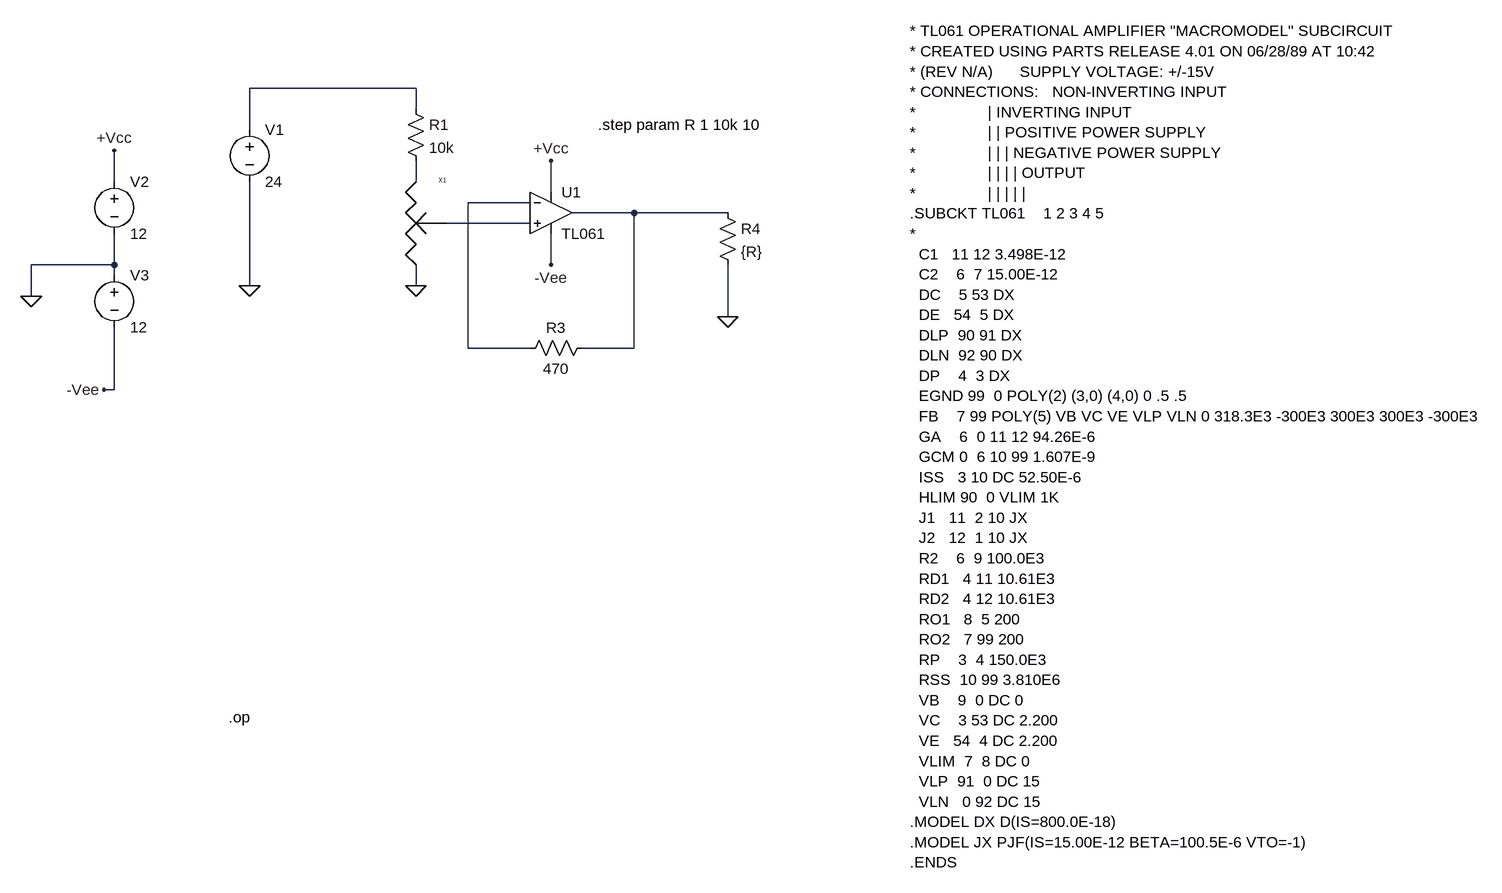
[diagram p0: schematic uklad.asc]
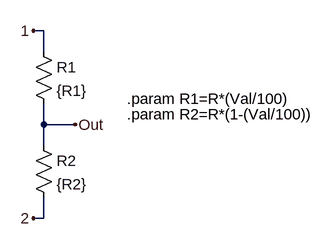
[diagram p1: sub-circuit potentiometer.asc]
uklad.asc, the LTspice schematic file:
Version 4
SHEET 1 3900 1348
WIRE -16 272 -272 272
WIRE -16 304 -16 272
WIRE -272 336 -272 272
WIRE -480 416 -480 368
WIRE -16 416 -16 384
WIRE 192 432 192 384
WIRE 160 448 64 448
WIRE 320 464 224 464
WIRE 464 464 320 464
WIRE 160 480 32 480
WIRE -480 544 -480 496
WIRE -480 544 -608 544
WIRE 192 544 192 496
WIRE -480 560 -480 544
WIRE -272 576 -272 416
WIRE -16 576 -16 544
WIRE -608 592 -608 544
WIRE 464 624 464 544
WIRE 64 672 64 448
WIRE 160 672 64 672
WIRE 320 672 320 464
WIRE 320 672 240 672
WIRE -480 736 -480 640
WIRE -480 736 -496 736
FLAG -16 576 0
FLAG -272 576 0
FLAG 464 624 0
FLAG -480 368 +Vcc
FLAG 192 384 +Vcc
FLAG 192 544 -Vee
FLAG -608 592 0
FLAG -496 736 -Vee
SYMBOL res -32 288 R0
SYMATTR InstName R1
SYMATTR Value 10k
SYMBOL res 256 656 R90
WINDOW 0 0 56 VBottom 2
WINDOW 3 32 56 VTop 2
SYMATTR InstName R3
SYMATTR Value 470
SYMBOL res 448 448 R0
SYMATTR InstName R4
SYMATTR Value {R}
SYMBOL voltage -272 320 R0
WINDOW 123 0 0 Left 0
WINDOW 39 0 0 Left 0
SYMATTR InstName V1
SYMATTR Value 24
SYMBOL OpAmps\\opamp2 192 400 R0
SYMATTR InstName U1
SYMATTR Value TL061
SYMBOL Potentiometer -16 480 R0
SYMATTR InstName X1
SYMATTR SpiceLine R=10k,Val=20
SYMBOL voltage -480 400 R0
WINDOW 123 0 0 Left 0
WINDOW 39 0 0 Left 0
SYMATTR InstName V2
SYMATTR Value 12
SYMBOL voltage -480 544 R0
WINDOW 123 0 0 Left 0
WINDOW 39 0 0 Left 0
SYMATTR InstName V3
SYMATTR Value 12
TEXT 744 184 Left 2 !* TL061 OPERATIONAL AMPLIFIER "MACROMODEL" SUBCIRCUIT\n* CREATED USING PARTS RELEASE 4.01 ON 06/28/89 AT 10:42\n* (REV N/A)      SUPPLY VOLTAGE: +/-15V\n* CONNECTIONS:   NON-INVERTING INPUT\n*                | INVERTING INPUT\n*                | | POSITIVE POWER SUPPLY\n*                | | | NEGATIVE POWER SUPPLY\n*                | | | | OUTPUT\n*                | | | | |\n.SUBCKT TL061    1 2 3 4 5\n*\n  C1   11 12 3.498E-12\n  C2    6  7 15.00E-12\n  DC    5 53 DX\n  DE   54  5 DX\n  DLP  90 91 DX\n  DLN  92 90 DX\n  DP    4  3 DX\n  EGND 99  0 POLY(2) (3,0) (4,0) 0 .5 .5\n  FB    7 99 POLY(5) VB VC VE VLP VLN 0 318.3E3 -300E3 300E3 300E3 -300E3\n  GA    6  0 11 12 94.26E-6\n  GCM 0  6 10 99 1.607E-9\n  ISS   3 10 DC 52.50E-6\n  HLIM 90  0 VLIM 1K\n  J1   11  2 10 JX\n  J2   12  1 10 JX\n  R2    6  9 100.0E3\n  RD1   4 11 10.61E3\n  RD2   4 12 10.61E3\n  RO1   8  5 200\n  RO2   7 99 200\n  RP    3  4 150.0E3\n  RSS  10 99 3.810E6\n  VB    9  0 DC 0\n  VC    3 53 DC 2.200\n  VE   54  4 DC 2.200\n  VLIM  7  8 DC 0\n  VLP  91  0 DC 15\n  VLN   0 92 DC 15\n.MODEL DX D(IS=800.0E-18)\n.MODEL JX PJF(IS=15.00E-12 BETA=100.5E-6 VTO=-1)\n.ENDS
TEXT 264 328 Left 2 !.step param R 1 10k 10
TEXT -304 1240 Left 2 !.op

potentiometer.asc, the sub-circuit schematic file:
Version 4
SHEET 1 880 680
WIRE 144 16 128 16
WIRE 144 48 144 16
WIRE 144 160 144 128
WIRE 192 160 144 160
WIRE 144 192 144 160
WIRE 144 304 144 272
WIRE 144 304 128 304
FLAG 128 16 1
FLAG 128 304 2
FLAG 192 160 Out
SYMBOL res 128 32 R0
SYMATTR InstName R1
SYMATTR Value {R1}
SYMBOL res 128 176 R0
SYMATTR InstName R2
SYMATTR Value {R2}
TEXT 272 120 Left 2 !.param R1=R*(Val/100)
TEXT 272 144 Left 2 !.param R2=R*(1-(Val/100))

The netlist it stands for:
* uklad.asc
R1 N001 N002 10k
R3 N004 N003 470
R4 N004 0 {R}
V1 N001 0 24
XU1 N005 N003 +Vcc -Vee N004 TL061  ; pins In+ In- V+ V- OUT
XX1 N002 0 N005 potentiometer params: R=10k,Val=20
V2 +Vcc 0 12
V3 0 -Vee 12

* block symbol definitions
.subckt potentiometer 1 2 Out
R1 1 Out {R1}
R2 Out 2 {R2}
.param R1=R*(Val/100)
.param R2=R*(1-(Val/100))
.ends potentiometer

* TL061 OPERATIONAL AMPLIFIER "MACROMODEL" SUBCIRCUIT
* CREATED USING PARTS RELEASE 4.01 ON 06/28/89 AT 10:42
* (REV N/A)      SUPPLY VOLTAGE: +/-15V
* CONNECTIONS:   NON-INVERTING INPUT
*                | INVERTING INPUT
*                | | POSITIVE POWER SUPPLY
*                | | | NEGATIVE POWER SUPPLY
*                | | | | OUTPUT
*                | | | | |
.SUBCKT TL061    1 2 3 4 5
*
  C1   11 12 3.498E-12
  C2    6  7 15.00E-12
  DC    5 53 DX
  DE   54  5 DX
  DLP  90 91 DX
  DLN  92 90 DX
  DP    4  3 DX
  EGND 99  0 POLY(2) (3,0) (4,0) 0 .5 .5
  FB    7 99 POLY(5) VB VC VE VLP VLN 0 318.3E3 -300E3 300E3 300E3 -300E3
  GA    6  0 11 12 94.26E-6
  GCM 0  6 10 99 1.607E-9
  ISS   3 10 DC 52.50E-6
  HLIM 90  0 VLIM 1K
  J1   11  2 10 JX
  J2   12  1 10 JX
  R2    6  9 100.0E3
  RD1   4 11 10.61E3
  RD2   4 12 10.61E3
  RO1   8  5 200
  RO2   7 99 200
  RP    3  4 150.0E3
  RSS  10 99 3.810E6
  VB    9  0 DC 0
  VC    3 53 DC 2.200
  VE   54  4 DC 2.200
  VLIM  7  8 DC 0
  VLP  91  0 DC 15
  VLN   0 92 DC 15
.MODEL DX D(IS=800.0E-18)
.MODEL JX PJF(IS=15.00E-12 BETA=100.5E-6 VTO=-1)
.ENDS
.step param R 1 10k 10
.op
.backanno
.end